# Altium project Hexrotor MA600 Breakout.PrjPcb
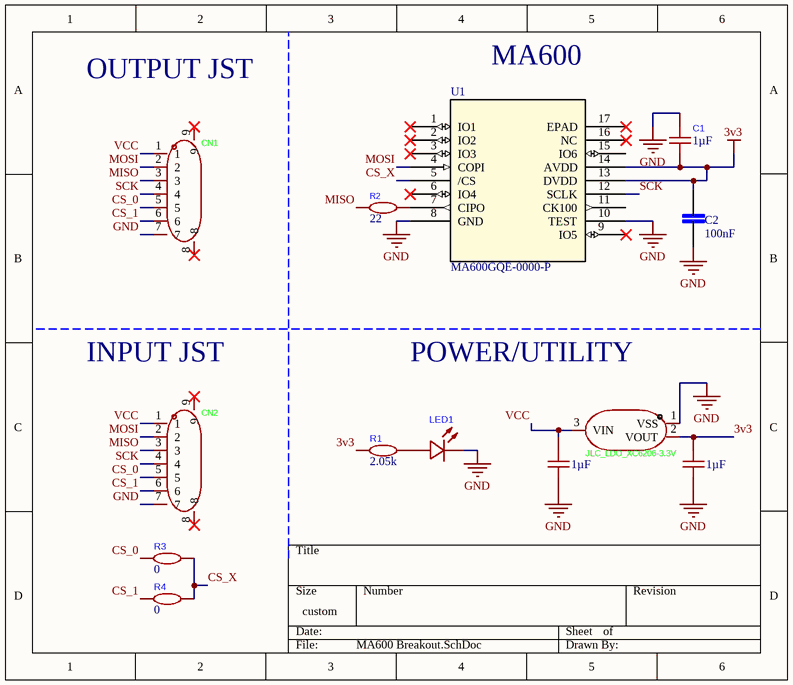
[diagram p0: MA600 Breakout.SchDoc]
1 sheet, 13 parts. Net scope: global (net labels, ports and power ports of the same name join across sheets).
Board file: MA600 Breakout v3.PcbDoc

## Sheet MA600 Breakout.SchDoc
size 147 x 127 mm; SheetNumber: 1; SheetTotal: 1

### Parts
C1  value 1µF  [C0603]  (hidden comment: CL10A105KB8NNNC)
C2  value 100nF  [CAPC1608X90]  (hidden comment: C0603C104K5RACTU)
C3  value 1µF  [C0402]  (hidden comment: JLC_1uF_0402_CL05A105KA5NQNC)
C4  value 1µF  [C0402]  (hidden comment: JLC_1uF_0402_CL05A105KA5NQNC)
CN1  JLC_7P_TOP_ENTRY_BM07B-GHS-TBT(LF)(SN)(N)  [CONN-SMD_7P-P1.25_BM07B-GHS-TBT-LF-SN-N]  (value not drawn)
CN2  JLC_7P_TOP_ENTRY_BM07B-GHS-TBT(LF)(SN)(N)  [CONN-SMD_7P-P1.25_BM07B-GHS-TBT-LF-SN-N]  (value not drawn)
LED1  BLUE_LED_JLC_KT-0603B  [LED0603-RD]  (value not drawn)
R1  value 2.05k  [R0603]  (hidden comment: JLC_0603WAF2051T5E)
R2  value 22  [R0402]  (hidden comment: JLC_22_0402WGF220JTCE)
R3  value 0  [R0603]  (hidden comment: 0 ohm_JLC_0603WAJ0000T5E)
R4  value 0  [R0603]  (hidden comment: 0 ohm_JLC_0603WAJ0000T5E)
U1  MA600GQE-0000-P  [QFN-16_MA600_MNP]
U2  JLC_LDO_XC6206-3.3V  [SOT-23-3_L2.9-W1.3-P0.95-LS2.4-BR]

### Nets
3v3: C1.1 C2.1 C3.2 R1.1 U1.13(DVDD) U1.14(AVDD) U2.2(VOUT)
GND: C1.2 C2.2 C3.1 C4.1 CN1.7 CN2.7 LED1.1(K) U1.8(GND) U1.10(TEST) U2.1(VSS)
CS_0: CN1.5 CN2.5 R3.1
CS_1: CN1.6 CN2.6 R4.1
CS_X: R3.2 R4.2 U1.5(/CS)
MISO: CN1.3 CN2.3 R2.1
MOSI: CN1.2 CN2.2 U1.4(COPI)
SCK: CN1.4 CN2.4 U1.12(SCLK)
VCC: C4.2 CN1.1 CN2.1 U2.3(VIN)
NetLED1_2: LED1.2(A) R1.2
NetR2_2: R2.2 U1.7(CIPO)

Not connected (* = marked no-connect by the designer): CN1 8* 9*; CN2 8* 9*; U1 1(IO1)* 2(IO2)* 3(IO3)* 6(IO4)* 9(IO5)* 11(CK100) 15(IO6) 16(NC)* 17(EPAD)*

### Notes on the sheet
- OUTPUT JST
- MA600
- (near CN2) INPUT JST
- POWER/UTILITY

### Library data of the parts
C1 = CMP-001-00100-1: Manufacturer: SAMSUNG(三星); Add into BOM: yes; Temperature Coefficient: X5R; Tolerance: 10%; Voltage Rating: 50V; Symbol: CL10A105KB8NNNC; Source: CL10A105KB8NNN_1uF.SCHLIB; Supplier Part: C15849; Manufacturer Part: CL10A105KB8NNNC; Device: CL10A105KB8NNNC; JLCPCB Part Class: Basic Part; LCSC Part Name: 1uF ±10% 50V; Convert to PCB: yes; Supplier Footprint: 0603; Datasheet: https://item.szlcsc.com/datasheet/CL10A105KB8NNNC/16531.html; Design Item ID: CL10A105KB8NNNC
C2 = CMP-001-00085-1: 0.1 ÂµF Â±10% 50V Ceramic Capacitor X7R 0603 (1608 Metric); MF: KEMET; Design Item ID: C0603C104K5RACTU; MP: C0603C104K5RACTU; Case/Package: 603-2 KEMET; Component Type: Standard; SnapEDA_Link: https://www.snapeda.com/parts/C0603C104K5RACTU/KEMET/view-part/?ref=snap; Check_prices: https://www.snapeda.com/parts/C0603C104K5RACTU/KEMET/view-part/?ref=eda; Pins: 2; Source: C0603C104K5RACTU.SchLib
C3 C4 = CMP-001-00121-1: 1uF 25V X5R ±10% 0402 Multilayer Ceramic Capacitors MLCC - SMD/SMT ROHS; Manufacturer: SAMSUNG(三星); Convert to PCB: yes; Supplier Footprint: 0402; Supplier Part: C52923; Voltage Rating: 25V; Datasheet: https://item.szlcsc.com/datasheet/CL05A105KA5NQNC/53938.html; Device: CL05A105KA5NQNC; Source: CL05A105KA5NQNC1_CL05A105KA5NQNC.SCHLIB; Manufacturer Part: CL05A105KA5NQNC; Symbol: CL05A105KA5NQNC; Design Item ID: JLC_1uF_0402_CL05A105KA5NQNC; Temperature Coefficient: X5R; LCSC Part Name: 1uF ±10% 25V; Add into BOM: yes; JLCPCB Part Class: Basic Part; Tolerance: 10%
CN1 CN2 = CMP-001-00120-1: -25℃~+85℃ 1 1.25mm 12mm 1A 1x7P 4.05mm 4.32mm 50V 7 7P Auxiliary Solder Pin GH PA9T Phosphor bronze Surface Mount,Vertical Tin UL94V-0 White SMD,P=1.25mm Wire To Board Connector ROHS; Manufacturer: JST; Add into BOM: yes; Number of PINs Per Row: 7; Supplementary Features: Auxiliary soldering legs; Flame Retardant Rating: UL94V-0; Contact Material: Phosphor Bronze; X-Length of Bottom Edge on Board (Spacing Line): 12mm; Row Spacing: -; Number of Rows: 1; Supplier Part: C378970; Colour: White; Reference Series: GH; Manufacturer Part: BM07B-GHS-TBT(LF)(SN)(N); Contact Plating: Tin; Rated Voltage (Max): 50V; Datasheet: https://atta.szlcsc.com/upload/public/pdf/source/20190411/C378970_7BCD15E79143F499DF63A80CF437C3FA.pdf; Mounting Style: Standing paste; Design Item ID: JLC_7P_TOP_ENTRY_BM07B-GHS-TBT(LF)(SN)(N); Z-Height of the Board: 4.05mm; Device: BM07B-GHS-TBT(LF)(SN)(N); Current Rating (Max): 1A; Plastic Material: PA9T; Pins Structure: 1x7P; Symbol: BM07B-GHS-TBT(LF)(SN)(N); Pins: 7P; Source: BM07B-GHS-TBT(LF)(SN)(N)1_BM07B-GHS-TBT(LF)(SN)(N).SCHLIB; Pitch: 1.25mm; Convert to PCB: yes; LCSC Part Name: 1x7P 间距:1.25mm 立贴 系列:GH; Operating Temperature Range: -25℃~+85℃; Supplier Footprint: SMD,P=1.25mm; JLCPCB Part Class: Extended Part; Y-Width of Bottom Edge on Board: 4.32mm
LED1 = CMP-007-00036-1: 100mW 120° 175mcd 3.1V 460nm~475nm 469nm 5mA Blue Water Clear 0603 LED Indication - Discrete ROHS; Manufacturer: KENTO; Add into BOM: yes; Symbol: Blue light 0603; Peak Wavelength: 469nm; Supplier Footprint: 0603; Supplier Part: C2288; Source: Blue_LED_JLC_Blue light 06031.SCHLIB; Convert to PCB: yes; JLCPCB Part Class: Extended Part; Power(Watts): 100mW; Viewing Angle: 120°; Wavelength - Dominant: 460nm~475nm; Datasheet: https://item.szlcsc.com/datasheet/KT-0603B/2661.html; Forward Current: 5mA; Design Item ID: BLUE_LED_JLC_KT-0603B; Device: KT-0603B; Mounting Style: -; Operating Temperature: -; Color Temperature: -; Lens Color: Water Clear; Voltage - Forward(Vf): 3.1V; Diode Configuration: -; Luminous Intensity: 175mcd; LCSC Part Name: 0603 蓝灯 高亮; Manufacturer Part: KT-0603B; Illumination Color: Blue
R1 = CMP-009-00217-1: -55℃~+155℃ 100mW 2.05kΩ 75V Thick Film Resistor ±1% ±100ppm/℃ 0603 Chip Resistor - Surface Mount ROHS; Manufacturer: UNI-ROYAL(厚声); Add into BOM: yes; Power(Watts): 100mW; Device: 0603WAF2051T5E; LCSC Part Name: 2.05kΩ ±1% 100mW 厚膜电阻; Type: Thick Film Resistor; Manufacturer Part: 0603WAF2051T5E; Symbol: 0603WAF2051T5E; Voltage-Supply(Max): 75V; Temperature Coefficient: ±100ppm/℃; Source: 0603WAF2051T5E1_0603WAF2051T5E.SCHLIB; Convert to PCB: yes; Datasheet: https://item.szlcsc.com/datasheet/0603WAF2051T5E/23627.html; Tolerance: 1%; Design Item ID: JLC_0603WAF2051T5E; Supplier Part: C22900; JLCPCB Part Class: Extended Part; Supplier Footprint: 0603; Operating Temperature: -55℃~+155℃
R2 = CMP-009-00220-2: -55℃~+155℃ 22Ω 50V 62.5mW Thick Film Resistor ±1% ±100ppm/℃ 0402 Chip Resistor - Surface Mount ROHS; Manufacturer: UNI-ROYAL(厚声); Add into BOM: yes; JLCPCB Part Class: Basic Part; Temperature Coefficient: ±100ppm/℃; Tolerance: 1%; Source: 0402WGF220JTCE1_0402WGF220JTCE.SCHLIB; Datasheet: https://atta.szlcsc.com/upload/public/pdf/source/20200306/C422600_1E6D84923E4A46A82E41ADD87F860B5C.pdf; Supplier Footprint: 0402; Type: Thick Film Resistors; Convert to PCB: yes; Operating Temperature Range: -55℃~+155℃; Design Item ID: 0402WGF220JTCE; Supplier Part: C25092; Symbol: 0402WGF220JTCE; Device: 0402WGF220JTCE; Manufacturer Part: 0402WGF220JTCE; LCSC Part Name: 22Ω ±1% 62.5mW 厚膜电阻
R3 R4 = CMP-009-00196-1: 0 ohm chip resistor 0603 -55℃~+155℃ 0Ω 100mW 75V Thick Film Resistor ±5% ±800ppm/℃ 0603 Chip Resistor - Surface Mount ROHS; Manufacturer: UNI-ROYAL(厚声); Add into BOM: yes; Supplier Part: C15402; Design Item ID: 0 ohm_JLC_0603WAJ0000T5E; Supplier Footprint: 0603; Voltage-Supply(Max): 75V; Manufacturer Part: 0603WAJ0000T5E; Operating Temperature: -55℃~+155℃; Source: 0 ohm_JLC_0603WAJ0000T5E1.SCHLIB; Tolerance: 5%; Device: 0603WAJ0000T5E; Power(Watts): 100mW; JLCPCB Part Class: Extended Part; Temperature Coefficient: ±800ppm/℃; LCSC Part Name: 0Ω ±5% 100mW 厚膜电阻; Type: Thick Film Resistor; Symbol: 0603WAJ0000T5E; Datasheet: https://item.szlcsc.com/datasheet/0603WAJ0000T5E/16080.html; Convert to PCB: yes
U1 = CMP-319-000000-1: QFN-16-EP(3x3) Magnetic Angle Sensors ROHS; Manufacturer_Name: Monolithic Power Systems; Type: Type; Design Item ID: MA600GQE-0000-P; Copyright: Copyright (C) 2025 Ultra Librarian. All rights reserved.; Manufacturer_Part_Number: MA600GQE-0000-P; RefDes: RefDes; Source: MA600GQE-0000-P_edited.SchLib
U2 = CMP-340-000000-1: -40℃~+125℃@(Tj) 1 1uA 250mA 3.3V 6V 75mV@(30mA) Fixed Over Current Protection、Short Circuit Protection Positive SOT-23 Voltage Regulators - Linear, Low Drop Out (LDO) Regulators ROHS; Manufacturer: YONGYUTAI(永裕泰); Number of Outputs: 1; Convert to PCB: yes; Symbol: XC6206-3.3V_C3015484; Output Type: Fixed; Voltage - Supply: 6V; LCSC Part Name: 3.3V 250mA 6V; Supplier Footprint: SOT-23; standby current: 1uA; Power Supply Rejection Ratio (PSRR): -; Supplier Part: C3015484; Features: Over Current Protection；Short Circuit Protection; JLCPCB Part Class: Extended Part; Source: XC6206-3.3V_C30154841_XC6206-3.3V_C3015484.SCHLIB; Operating Temperature: -40℃~+125℃@(Tj); Voltage Dropout: 75mV@(30mA); Output Voltage: 3.3V; Device: XC6206-3.3V; Add into BOM: yes; Noise: -; Output Configuration: Positive; Manufacturer Part: XC6206-3.3V; Design Item ID: JLC_LDO_XC6206-3.3V; Datasheet: https://item.szlcsc.com/datasheet/XC6206-3.3V/3527846.html; Output Current: 250mA